# EAGLE design untitled (EAGLE 9.6.2)
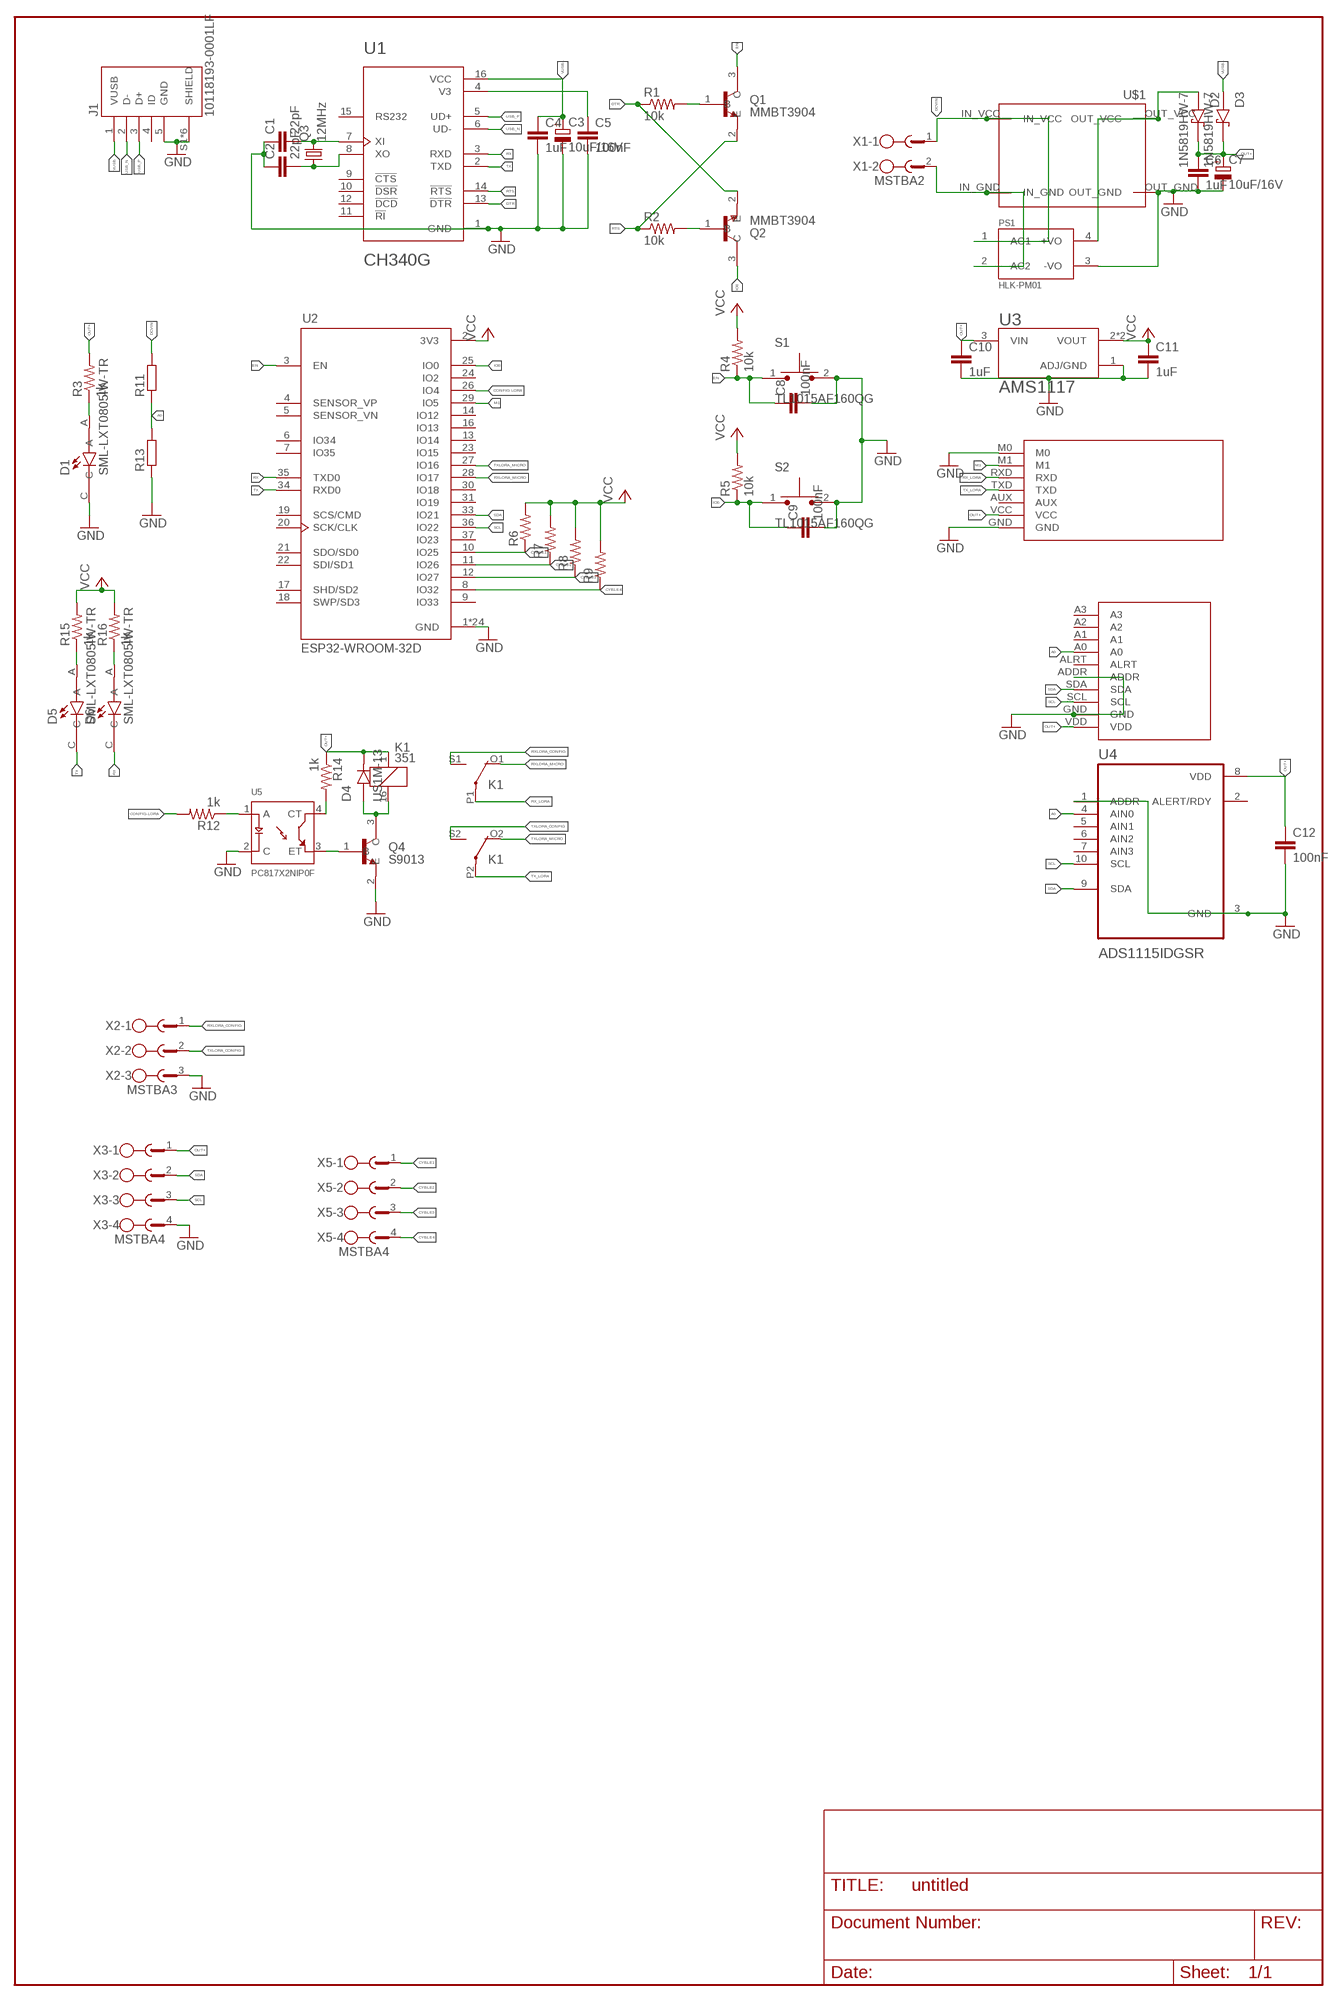
[diagram p0: schematic, sheet 1]

## Parts
ADS1  ADS1115  [ADS1115]
C1  22pF  C-EUC0805K  [C0805K]
C2  22pF  C-EUC0805K  [C0805K]
C3  10uF/16V  CPOL-EU153CLV-0505  [153CLV-0505]
C4  1uF  C-EUC0805K  [C0805K]
C5  100nF  C-EUC0805K  [C0805K]
C6  1uF  C-EUC0805K  [C0805K]
C7  10uF/16V  CPOL-EU153CLV-0505  [153CLV-0505]
C8  100nF  C-EUC0805K  [C0805K]
C9  100nF  C-EUC0805K  [C0805K]
C10  1uF  C-EUC0805K  [C0805K]
C11  1uF  C-EUC0805K  [C0805K]
C12  100nF  C-EUC0805K  [C0805K]
D1  SML-LXT0805IW-TR  [LEDC2012X120N]
D2  1N5819HW-7  [SOD3715X145N]
D3  1N5819HW-7  [SOD3715X145N]
D4  US1M-13  [DIOM5226X240N]
D5  SML-LXT0805IW-TR  [LEDC2012X120N]
D6  SML-LXT0805IW-TR  [LEDC2012X120N]
EBYTEE220-900T22D1  EBYTEE220-900T22D  [EBYTEE220-900T22D]
J1  10118193-0001LF  [FCI_10118193-0001LF]
K1  351  [351]
PS1  HLK-PM01  [CONV_HLK-PM01]
Q1  MMBT3904  [SOT95P240X120-3N]
Q2  MMBT3904  [SOT95P240X120-3N]
Q3  12MHz  CRYSTALSM49  [SM49]
Q4  S9013  [SOT95P240X120-3N]
R1  10k  R-US_M0805  [M0805]
R2  10k  R-US_M0805  [M0805]
R3  1k  R-US_M0805  [M0805]
R4  10k  R-US_M0805  [M0805]
R5  10k  R-US_M0805  [M0805]
R6  R-US_M0805  [M0805]
R7  R-US_M0805  [M0805]
R8  R-US_M0805  [M0805]
R9  R-US_M0805  [M0805]
R11  R-EU_0207/12  [0207/12]
R12  1k  R-US_M0805  [M0805]
R13  R-EU_0207/12  [0207/12]
R14  1k  R-US_M0805  [M0805]
R15  1k  R-US_M0805  [M0805]
R16  1k  R-US_M0805  [M0805]
S1  TL1015AF160QG  [SW_TL1015AF160QG]
S2  TL1015AF160QG  [SW_TL1015AF160QG]
U1  CH340G  [SOIC127P600X180-16N]
U2  ESP32-WROOM-32D  [MODULE_ESP32-WROOM-32D]
U3  AMS1117  [SOT229P700X180-4N]
U4  ADS1115IDGSR  [SOP50P490X110-10N]
U5  PC817X2NIP0F  [SOT254P975X400-4N]
U$1  STEPDOWN_SY8205  [STEPDOWN_SY8205]
X1  MSTBA2  [MSTBA2]
X2  MSTBA3  [MSTBA3]
X3  MSTBA4  [MSTBA4]
X5  MSTBA4  [MSTBA4]

## Nets
A0: ADS1.A0 R11.1 R13.2 U4.4(AIN0)
CONFIG-LORA: R12.2 U2.26(IO4)
CYBLE1: R6.1 U2.10(IO25) X5.1
CYBLE2: R7.1 U2.11(IO26) X5.2
CYBLE3: R8.1 U2.12(IO27) X5.3
CYBLE4: R9.1 U2.8(IO32) X5.4
DCVIN: PS1.1(AC1) R11.2 U$1.IN_VCC X1.1
DTR: Q2.2(E) R1.1 U1.13(!DTR)
EN: C8.1 Q1.3(C) R4.1 S1.1 U2.3(EN)
GND: ADS1.ADDR ADS1.GND C1.1 C2.1 C3.- C4.2 C5.2 C6.2 C7.- C8.2 C9.2 C10.2 C11.2 C12.2 D1.C EBYTEE220-900T22D1.GND EBYTEE220-900T22D1.M0 J1.5(GND) J1.S1(SHIELD) J1.S2(SHIELD) J1.S3(SHIELD) J1.S4(SHIELD) J1.S5(SHIELD) J1.S6(SHIELD) PS1.3(-VO) Q4.2(E) R13.1 S1.2 S2.2 U1.1(GND) U2.1(GND) U2.15(GND) U2.38(GND) U2.39_1(GND) U2.39_2(GND) U2.39_3(GND) U2.39_4(GND) U2.39_5(GND) U2.39_6(GND) U2.39_7(GND) U2.39_8(GND) U2.39_9(GND) U2.39_10(GND) U2.39_11(GND) U2.39_12(GND) U2.39_13(GND) U2.39_14(GND) U2.39_15(GND) U2.39_16(GND) U2.39_17(GND) U2.39_18(GND) U2.39_19(GND) U2.39_20(GND) U2.39_21(GND) U3.1(ADJ/GND) U4.1(ADDR) U4.3(GND) U5.2(C) U$1.OUT_GND X2.3 X3.4
IO0: C9.1 Q2.3(C) R5.1 S2.1 U2.25(IO0)
M1: EBYTEE220-900T22D1.M1 U2.29(IO5)
N$1: C1.2 Q3.2 U1.7(XI)
N$2: C2.2 Q3.1 U1.8(XO)
N$3: Q1.1(B) R1.2
N$4: Q2.1(B) R2.2
N$5: C5.1 U1.4(V3)
N$6: R12.1 U5.1(A)
N$7: D2.A PS1.4(+VO) U$1.OUT_VCC
N$8: Q4.1(B) U5.3(ET)
N$9: R14.2 U5.4(CT)
N$10: PS1.2(AC2) U$1.IN_GND X1.2
N$11: D1.A R3.1
N$12: D5.A R15.1
N$13: D4.A K1.16 Q4.3(C)
N$14: D6.A R16.1
OUT+: ADS1.VDD C6.1 C7.+ C10.1 C12.1 D2.C(K) D3.C(K) D4.C(K) EBYTEE220-900T22D1.VCC K1.1 R3.2 R14.1 U3.3(VIN) U4.8(VDD) X3.1
RTS: Q1.2(E) R2.1 U1.14(!RTS)
RX: D6.C U1.3(RXD) U2.35(TXD0)
RX_LORA: EBYTEE220-900T22D1.RXD K1.P1(2:P)
RXLORA_CONFIG: K1.S1(2:S) X2.1
RXLORA_MICRO: K1.O1(2:O) U2.28(IO17)
SCL: ADS1.SCL U2.36(IO22) U4.10(SCL) X3.3
SDA: ADS1.SDA U2.33(IO21) U4.9(SDA) X3.2
TX: D5.C U1.2(TXD) U2.34(RXD0)
TX_LORA: EBYTEE220-900T22D1.TXD K1.P2(3:P)
TXLORA_CONFIG: K1.S2(3:S) X2.2
TXLORA_MICRO: K1.O2(3:O) U2.27(IO16)
USB_N: J1.2(D-) U1.6(UD-)
USB_P: J1.3(D+) U1.5(UD+)
VCC: C11.1 R4.2 R5.2 R6.2 R7.2 R8.2 R9.2 R15.2 R16.2 U2.2(3V3) U3.2(VOUT) U3.4(VOUT)
VUSB: C3.+ C4.1 D3.A J1.1(VUSB) U1.16(VCC)
Unconnected: ADS1.A1 ADS1.A2 ADS1.A3 ADS1.ALRT EBYTEE220-900T22D1.AUX J1.4(ID) U1.9(!CTS) U1.10(!DSR) U1.11(!RI) U1.12(!DCD) U1.15(RS232) U2.4(SENSOR_VP) U2.5(SENSOR_VN) U2.6(IO34) U2.7(IO35) U2.9(IO33) U2.13(IO14) U2.14(IO12) U2.16(IO13) U2.17(SHD/SD2) U2.18(SWP/SD3) U2.19(SCS/CMD) U2.20(SCK/CLK) U2.21(SDO/SD0) U2.22(SDI/SD1) U2.23(IO15) U2.24(IO2) U2.30(IO18) U2.31(IO19) U2.37(IO23) U4.2(ALERT/RDY) U4.5(AIN1) U4.6(AIN2) U4.7(AIN3)

## Library data of the parts
ADS1 = ds1115:ADS1115
C1 C2 C4-C6 C8-C12 = rcl:C-EU: CAPACITOR, European symbol; SPICEPREFIX: C
C3 C7 = rcl:CPOL-EU: POLARIZED CAPACITOR, European symbol; SPICEPREFIX: C
D1 D5 D6 = SML-LXT0805IW-TR:SML-LXT0805IW-TR: LED; Luminous Intensity:11µcd; Viewing Angle:140°; Forward Current:30mA; Forward Voltage:2V; Color:Red; LED Color:Red; Leaded Process Compatible:Yes; Lens Color:White; Mounting Type:Surface Mount ;RoHS Compliant: Yes Check availability <https://pricing.snapeda.com/parts/SML-LXT0805IW-TR/Lumex%20Opto/Components/view-part?ref=eda>; AVAILABILITY: In Stock; DESCRIPTION: Red - LED Indication - Discrete 2V 0805 (2012 Metric); MF: Lumex Opto/Components; MP: SML-LXT0805IW-TR; PACKAGE: 0805 Lumex; PRICE: None; PURCHASE-URL: https://pricing.snapeda.com/search/part/SML-LXT0805IW-TR/?ref=eda
D2 D3 = 1N5819HW-7:1N5819HW-7: 1N5819HW Series 40 V 1 A Surface Mount Schottky Barrier Rectifier - SOD-123 Check availability <https://pricing.snapeda.com/parts/1N5819HW-7/Diodes%20Inc./view-part?ref=eda>; AVAILABILITY: In Stock; DESCRIPTION: Diode Schottky 40 V 1A Surface Mount SOD-123; MF: Diodes Inc.; MP: 1N5819HW-7; PACKAGE: SOD-123 Fairchild Semiconductor; PRICE: None; PURCHASE-URL: https://pricing.snapeda.com/search/part/1N5819HW-7/?ref=eda
D4 = US1M-13:US1M-13: Diode, Fast Recovery, 1a, 1kv, Do-214ac-2, Full Reel Check availability <https://pricing.snapeda.com/parts/US1M-13/Diodes%20Incorporated/view-part?ref=eda>; AVAILABILITY: In Stock; DESCRIPTION: Diode Standard 1000 V 1A Surface Mount SMA; MF: Diodes Incorporated; MP: US1M-13; PACKAGE: DO-214AC-214 Diodes Incorporated; PRICE: None; PURCHASE-URL: https://pricing.snapeda.com/search/part/US1M-13/?ref=eda
EBYTEE220-900T22D1 = EByte E220-900T22D:EBYTEE220-900T22D
J1 = 10118193-0001LF:10118193-0001LF: Micro USB B Type Receptacle Check availability <https://pricing.snapeda.com/parts/10118193-0001LF/FCI/view-part?ref=eda>; AVAILABILITY: In Stock; DESCRIPTION: USB - micro B USB 2.0 Receptacle Connector 5 Position Surface Mount, Right Angle; Through Hole; MF: FCI; MP: 10118193-0001LF; PACKAGE: None; PRICE: None; PURCHASE-URL: https://pricing.snapeda.com/search/part/10118193-0001LF/?ref=eda
K1 = relay:351: RELAY 2 x switch, Omron; OC_FARNELL: unknown; OC_NEWARK: unknown
PS1 = HLK-PM01:HLK-PM01: Check availability <https://pricing.snapeda.com/parts/hlk-pm01/Hi-link/view-part?ref=eda>; AVAILABILITY: Not in stock; DESCRIPTION: The HLK-PM01 is a small size low cost AC to DC converter which can take in 110V/220V AC at 50/60 Hz and give 5V 3W output. The module is can be used in designs which run on 5V and needs to be powered form the AC mains.; MF: Hi-link; MP: hlk-pm01; PACKAGE: None; PRICE: None
Q1 Q2 = MMBT3904:MMBT3904: MMBT3904 Series 40 V CE Breakdown 0.2 A NPN General Purpose Amplifier - SOT-23 Check availability <https://pricing.snapeda.com/parts/MMBT3904/ON%20Semiconductor/view-part?ref=eda>; AVAILABILITY: In Stock; DESCRIPTION: Bipolar (BJT) Transistor NPN 40 V 200 mA 300MHz 300 mW Surface Mount SOT-23-3 (TO-236); MF: ON Semiconductor; MP: MMBT3904; PACKAGE: SOT-23-3 Motorola; PRICE: None
Q3 = adafruit:CRYSTAL: CRYSTAL; OC_FARNELL: unknown; OC_NEWARK: unknown
Q4 = S9013:S9013: SMD Transistors NPN 25V-500mA Check availability <https://pricing.snapeda.com/parts/S9013/JCET/view-part?ref=eda>; AVAILABILITY: In Stock; DESCRIPTION: Bipolar (BJT) Transistor NPN 20V 500mA 625mW Through Hole TO-92-3; MF: JCET; MP: S9013; PACKAGE: SOT-23-3 JCET; PRICE: None; PURCHASE-URL: https://pricing.snapeda.com/search/part/S9013/?ref=eda
R1-R9 R12 R14-R16 = rcl:R-US_: RESISTOR, American symbol; SPICEPREFIX: R
R11 R13 = rcl:R-EU_: RESISTOR, European symbol; SPICEPREFIX: R
S1 S2 = TL1015AF160QG:TL1015AF160QG: Tactile Switch SPST-NO Top Actuated Surface Mount Check availability <https://pricing.snapeda.com/parts/TL1015AF160QG/E-Switch/view-part?ref=eda>; AVAILABILITY: In Stock; DESCRIPTION: Tactile Switch SPST-NO Top Actuated Surface Mount; MF: E-Switch; MP: TL1015AF160QG; PACKAGE: None; PRICE: None; PURCHASE-URL: https://pricing.snapeda.com/search/part/TL1015AF160QG/?ref=eda
U1 = CH340G:CH340G: Check availability <https://pricing.snapeda.com/parts/Ch340G/WCH/view-part?ref=eda>; AVAILABILITY: Not in stock; DESCRIPTION: USB Interface Integrated Circuit; MF: WCH; MP: Ch340G; PACKAGE: None; PRICE: None
U2 = ESP32-WROOM-32D:ESP32-WROOM-32D: Bluetooth, WiFi 802.11b/g/n, Bluetooth v4.2 + EDR, Class 1, 2 and 3 Transceiver Module 2.4GHz ~ 2.5GHz Integrated, Trace Surface Mount Check availability <https://pricing.snapeda.com/parts/ESP32-WROOM-32D/Espressif%20Systems/view-part?ref=eda>; AVAILABILITY: In Stock; DESCRIPTION: Bluetooth, WiFi 802.11b/g/n, Bluetooth v4.2 +EDR, Class 1, 2 and 3 Transceiver Module 2.4GHz ~ 2.5GHz Integrated; MF: Espressif Systems; MP: ESP32-WROOM-32D; PACKAGE: Module Espressif Systems; PRICE: None; PURCHASE-URL: https://pricing.snapeda.com/search/part/ESP32-WROOM-32D/?ref=eda
U3 = AMS1117:AMS1117: Sot223/Pkg 1-Amp 5-Volt Low Drop Out Voltage Regulatator Check availability <https://pricing.snapeda.com/parts/AMS1117/Advanced%20Monolithic%20Systems/view-part?ref=eda>; AVAILABILITY: Not in stock; DESCRIPTION: 1A LOW DROPOUT VOLTAGE REGULATOR SOT-223; MF: Advanced Monolithic Systems; MP: AMS1117; PACKAGE: SOT-223 Seeed Technology; PRICE: None
U4 = ADS1115IDGSR:ADS1115IDGSR: Check availability <https://pricing.snapeda.com/parts/ADS1115IDGSR/Texas%20Instruments/view-part?ref=eda>; AVAILABILITY: In Stock; DESCRIPTION: 16-bit, 860-SPS, 4-channel, delta-sigma ADC with PGA, oscillator, VREF, comparator and I2C; MF: Texas Instruments; MP: ADS1115IDGSR; PACKAGE: VSSOP-10 Texas Instruments; PRICE: None; PURCHASE-URL: https://pricing.snapeda.com/search/part/ADS1115IDGSR/?ref=eda
U5 = PC817X2NIP0F:PC817X2NIP0F: PC817 Series 1 Channel 80 V 5000 Vrms General Purpose Photocoupler - DIP-4 Check availability <https://pricing.snapeda.com/parts/PC817X2NIP0F/Sharp%20Microelectronics/view-part?ref=eda>; AVAILABILITY: Not in stock; DESCRIPTION: Optoisolator Transistor Output 5000Vrms 1 Channel 4-SMD; MF: Sharp Microelectronics; MP: PC817X2NIP0F; PACKAGE: SMD-4 Sharp Microelectronics; PRICE: None
U$1 = STEPDOWN_SY8205:STEPDOWN_SY8205
X1 = con-phoenix-508:MSTBA2: PHOENIX; MF: FARNELL; MPN: 1757242; OC_FARNELL: 3705171; OC_NEWARK: 71C4161
X2 = con-phoenix-508:MSTBA3: PHOENIX; MF: FARNELL; MPN: 1757255; OC_FARNELL: 3705183; OC_NEWARK: 71C4162
X3 X5 = con-phoenix-508:MSTBA4: PHOENIX; MF: FARNELL; MPN: 1757268; OC_FARNELL: 3705195; OC_NEWARK: 71C4163

## Board
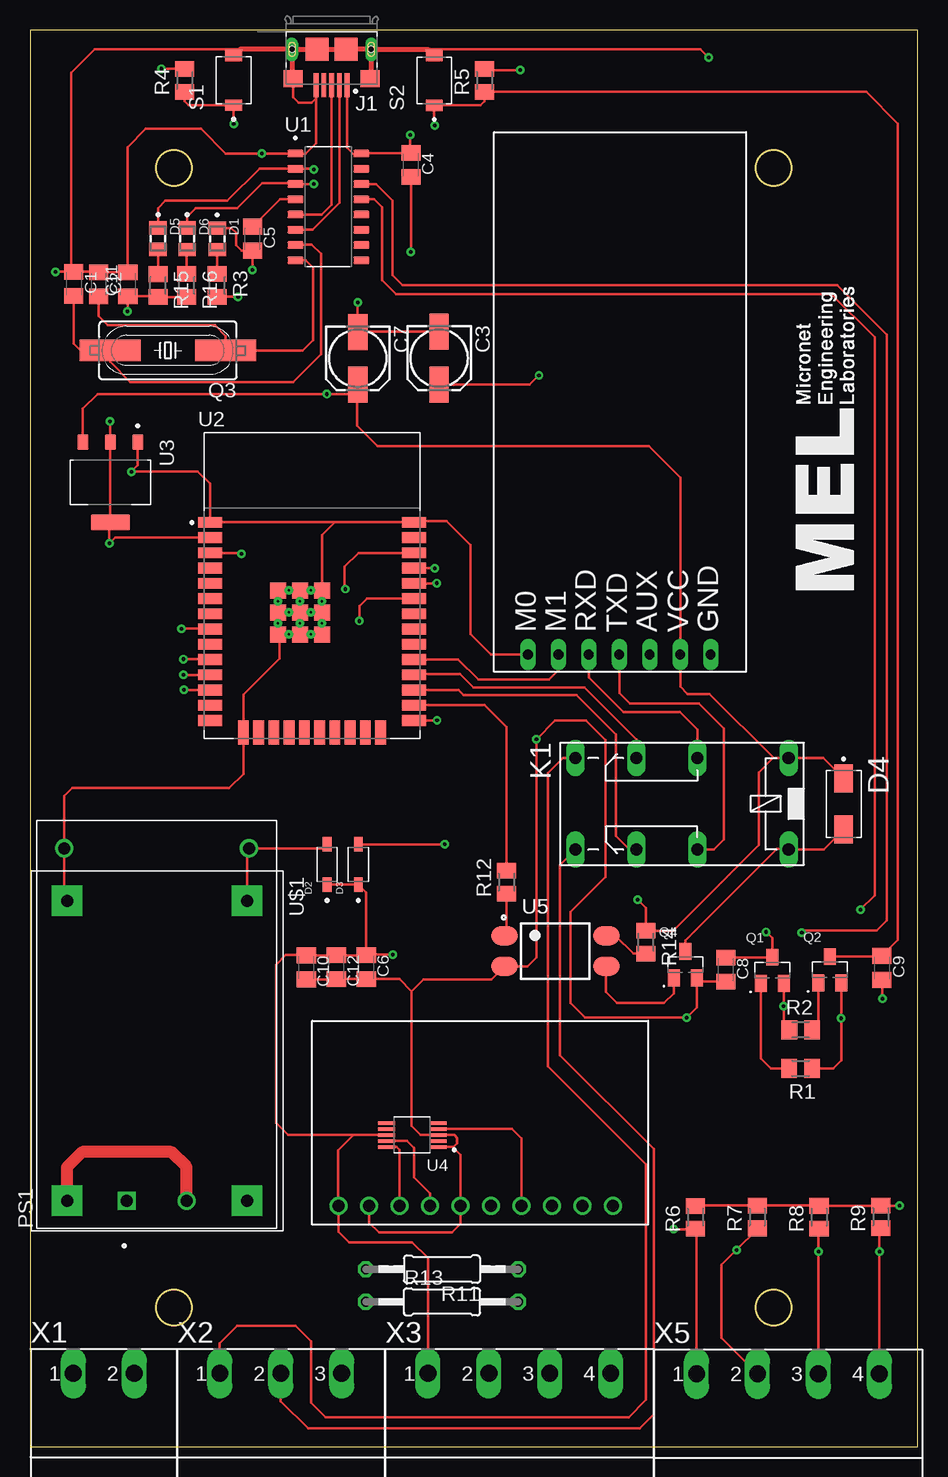
[diagram p1: board, top side]
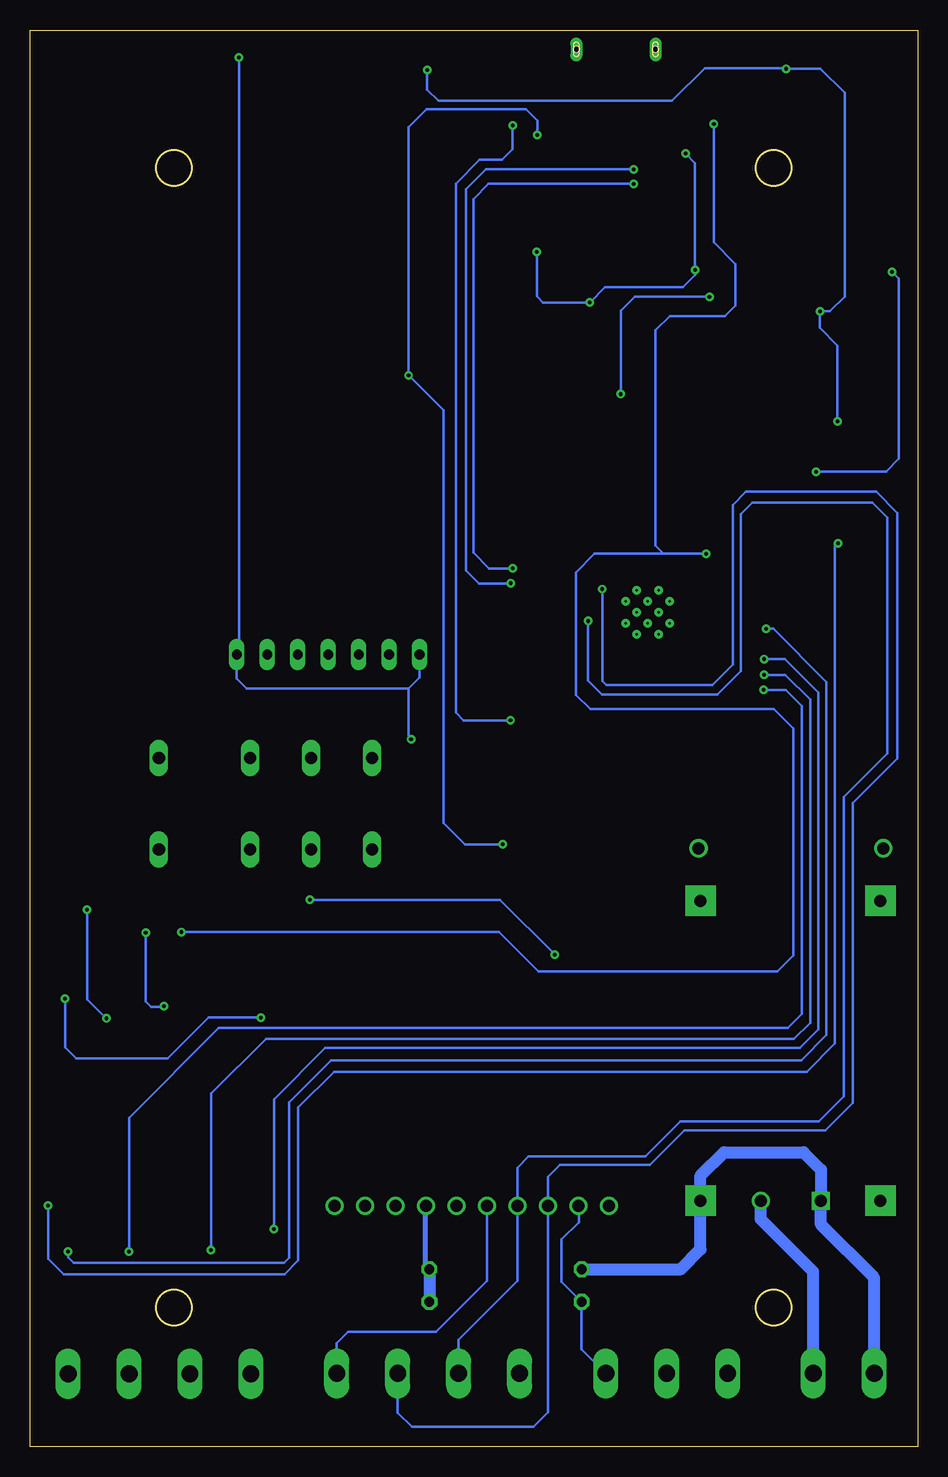
[diagram p2: board, bottom side, seen from below]

Size 74 x 118.1 mm. Coordinates in mm from the lower left corner, seen from the top.
Outline: 74,0 74,118.1 0,118.1 0,0 74,0
Outline: circle at 12,11.6 radius 1.5
Outline: circle at 62,11.6 radius 1.5
Outline: circle at 62,106.6 radius 1.5
Outline: circle at 12,106.6 radius 1.5
Copper layers (1*16): Top 0.035mm / dielectric 1.5mm / Bottom 0.035mm
Design rules "default *": minimum track width 6mil, minimum drill 0.3mm, track to track 6mil, track to pad 6mil, pad to pad 6mil, via to via 6mil, smd to smd 6mil, copper to edge 40mil, drill to drill 6mil, minimum pad ring 10mil, minimum via ring 8mil, stop-mask expansion 4mil, vias tented up to drill 0mil, thermal gap 10mil

### Footprints (pad centres in the part's own frame; a part is rotated, then mirrored left to right if it is on the bottom)
ADS1115 = drill 1: A0 -6.35,-1.27; A1 -6.35,-3.81; A2 -6.35,-6.35; A3 -6.35,-8.89; ADDR -6.35,3.81; ALRT -6.35,1.27; GND -6.35,11.43; SCL -6.35,8.89; SDA -6.35,6.35; VDD -6.35,13.97
C0805K = smd 1.3 x 1.6: 1 -1,0; 2 1,0
153CLV-0505 = smd 3 x 1.6: + 2.2,0; - -2.2,0
LEDC2012X120N = smd 1.1 x 1.45: A 0.9,0; C -0.9,0
SOD3715X145N = smd 1.21 x 0.73: A 1.68,0; C -1.68,0
DIOM5226X240N = smd 2.33 x 1.55: A 2.135,0; C -2.135,0
EBYTEE220-900T22D = drill 0.8 pad 1.27 long: AUX -4.56,-10.98; GND -4.56,-16.06; M0 -4.56,-0.82; M1 -4.56,-3.36; RXD -4.56,-5.9; TXD -4.56,-8.44; VCC -4.56,-13.52
FCI_10118193-0001LF = smd 0.4 x 2: 1 -1.3,2.975; 2 -0.65,2.975; 3 0,2.975; 4 0.65,2.975; 5 1.3,2.975 | smd 1.6 x 1.4: S1 -3.2,2.45; S2 3.2,2.45 | smd 1.9 x 1.9: S3 1.2,0; S4 -1.2,0 | drill 0.5 pad 0.9 long: S5 -3.3,0; S6 3.3,0 | hole 0.5: -3.3,0; 3.3,0
351 = drill 1.016 long: 1 -3.81,-3.81; 16 -3.81,3.81; O1 8.89,-3.81; O2 8.89,3.81; P1 3.81,-3.81; P2 3.81,3.81; S1 13.97,-3.81; S2 13.97,3.81
CONV_HLK-PM01 = drill 1 square: 1 -14.7,2.5 | drill 1: 2 -14.7,-2.5; 3 14.7,7.7; 4 14.7,-7.7
SOT95P240X120-3N = smd 1 x 1.4: 1 -0.95,-1.1; 2 0.95,-1.1; 3 0,1.1
SM49 = smd 5.08 x 1.778: 1 -4.826,0; 2 4.826,0
M0805 = smd 1.3 x 1.6: 1 -0.95,0; 2 0.95,0
0207/12 = drill 0.813 octagon: 1 -6.35,0; 2 6.35,0
SW_TL1015AF160QG = smd 0.95 x 1.4: 1 -2.075,0; 2 2.075,0
SOIC127P600X180-16N = smd 1.31 x 0.62: 1 -2.75,4.445; 2 -2.75,3.175; 3 -2.75,1.905; 4 -2.75,0.635; 5 -2.75,-0.635; 6 -2.75,-1.905; 7 -2.75,-3.175; 8 -2.75,-4.445; 9 2.75,-4.445; 10 2.75,-3.175; 11 2.75,-1.905; 12 2.75,-0.635; 13 2.75,0.635; 14 2.75,1.905; 15 2.75,3.175; 16 2.75,4.445
MODULE_ESP32-WROOM-32D = smd 2 x 0.9: 1 -8.5,5.26; 2 -8.5,3.99; 3 -8.5,2.72; 4 -8.5,1.45; 5 -8.5,0.18; 6 -8.5,-1.09; 7 -8.5,-2.36; 8 -8.5,-3.63; 9 -8.5,-4.9; 10 -8.5,-6.17; 11 -8.5,-7.44; 12 -8.5,-8.71; 13 -8.5,-9.98; 14 -8.5,-11.25; 25 8.5,-11.25; 26 8.5,-9.98; 27 8.5,-8.71; 28 8.5,-7.44; 29 8.5,-6.17; 30 8.5,-4.9; 31 8.5,-3.63; 32 8.5,-2.36; 33 8.5,-1.09; 34 8.5,0.18; 35 8.5,1.45; 36 8.5,2.72; 37 8.5,3.99; 38 8.5,5.26 | smd 0.9 x 2: 15 -5.715,-12.25; 16 -4.445,-12.25; 17 -3.175,-12.25; 18 -1.905,-12.25; 19 -0.635,-12.25; 20 0.635,-12.25; 21 1.905,-12.25; 22 3.175,-12.25; 23 4.445,-12.25; 24 5.715,-12.25 | smd 1.33 x 1.33: 39_1 -2.835,-0.405; 39_2 -1,-0.405; 39_3 0.835,-0.405; 39_4 -2.835,-2.24; 39_5 -1,-2.24; 39_6 0.835,-2.24; 39_7 -2.835,-4.075; 39_8 -1,-4.075; 39_9 0.835,-4.075 | drill 0.2 pad 0.3: 39_10 -1.917,-0.405; 39_11 -0.083,-0.405; 39_12 -2.835,-1.323; 39_13 -1,-1.323; 39_14 0.835,-1.323; 39_15 -1.917,-2.24; 39_16 -0.083,-2.24; 39_17 -2.835,-3.158; 39_18 -1,-3.158; 39_19 0.835,-3.158; 39_20 -1.917,-4.075; 39_21 -0.083,-4.075
SOT229P700X180-4N = smd 1.31 x 0.93: 1 -3.345,2.29; 2 -3.345,0; 3 -3.345,-2.29 | smd 1.31 x 3.24: 4 3.345,0
SOP50P490X110-10N = smd 1.47 x 0.28: 1 -2.15,1; 2 -2.15,0.5; 3 -2.15,0; 4 -2.15,-0.5; 5 -2.15,-1; 6 2.15,-1; 7 2.15,-0.5; 8 2.15,0; 9 2.15,0.5; 10 2.15,1
SOT254P975X400-4N = smd 2.25 x 1.6: 1 -4.25,1.27; 2 -4.25,-1.27; 3 4.25,-1.27; 4 4.25,1.27
STEPDOWN_SY8205 = drill 1 pad 2.54 square: IN_GND 18,-2.5; IN_VCC 3,-2.5; OUT_GND 18,-27.5; OUT_VCC 3,-27.5
MSTBA2 = drill 1.397 long: 1 -2.54,5.08; 2 2.54,5.08
MSTBA3 = drill 1.397 long: 1 -5.08,5.08; 2 0,5.08; 3 5.08,5.08
MSTBA4 = drill 1.397 long: 1 -7.62,5.08; 2 -2.54,5.08; 3 2.54,5.08; 4 7.62,5.08

### Placement (x,y rotation side)
ADS1  39.7,26.43 90 top
C1  3.66,96.93 270 top
C2  5.73,96.9 270 top
C3  34.11,90.74 270 top
C4  31.76,106.85 270 top
C5  18.56,100.71 270 top
C6  28.04,39.98 270 top
C7  27.33,90.73 270 top
C8  58.01,39.77 270 top
C9  71.03,39.92 270 top
C10  23.04,39.96 270 top
C11  8.16,96.9 90 top
C12  25.54,39.97 270 top
D1  15.61,100.69 270 top
D2  24.77,48.53 90 top
D3  27.38,48.54 90 top
D4  67.84,53.58 270 top
D5  10.68,100.7 270 top
D6  13.11,100.7 270 top
EBYTEE220-900T22D1  40.7,70.6 90 top
J1  25.15,116.49 180 top
K1  59.45,53.6 180 top
PS1  10.55,35.19 90 top
Q1  61.9,39.71 0 top
Q2  66.69,39.75 0 top
Q3  11.5,91.38 180 top
Q4  54.65,40.18 0 top
R1  64.26,31.53 180 top
R2  64.26,34.74 0 top
R3  15.61,96.8 270 top
R4  12.9,113.9 90 top
R5  37.9,113.89 90 top
R6  55.49,19.12 90 top
R7  60.64,19.16 90 top
R8  65.79,19.13 90 top
R9  70.93,19.16 90 top
R11  34.36,14.8 180 top
R12  39.73,47.06 90 top
R13  34.35,12.08 0 top
R14  51.36,42.06 270 top
R15  10.68,96.8 270 top
R16  13.06,96.8 270 top
S1  16.99,113.9 90 top
S2  33.71,113.88 90 top
U1  24.88,103.35 0 top
U2  23.51,71.79 0 top
U3  6.7,80.4 270 top
U4  31.87,25.99 180 top
U5  43.81,41.31 0 top
U$1  21.09,18.01 180 top
X1  6.15,1.04 0 top
X2  20.91,1.03 0 top
X3  40.8,1.03 0 top
X5  63.2,1 0 top

### Tracks (layer width: path | path; a pad name or v marks a point on that pad's centre or on a via)
A0
  Top 0.203: ADS1.A0 40.97,25.72 40.2,26.49 U4.4
  Bottom 0.406: ADS1.A0 41.05,20 41.05,15.15 R11.1
  Bottom 1.016: R11.1 R13.2
CONFIG-LORA
  Top 0.203: R12.2 39.73,59.98 37.9,61.81 U2.26
CYBLE1  (via drill 0.3)
  Top 0.203: X5.1 55.58,18.08 R6.1 55.45,18.14 v53.66,18.14 | v12.78,65.66 14.97,65.66 U2.10
  Bottom 0.203: v53.66,18.14 53.66,28.96 49.38,33.24 9.8,33.24 8.25,34.78 8.25,62.87 11.06,65.68 12.78,65.68 v12.78,65.66
CYBLE2  (via drill 0.3)
  Top 0.203: X5.2 57.65,9.09 57.65,15.15 v58.9,16.41 60.64,18.14 R7.1 | v12.79,64.34 U2.11
  Bottom 0.203: v58.9,16.41 58.9,29.43 54.33,34 10.3,34 8.96,35.34 8.96,62.27 11.03,64.34 v12.79,64.34
CYBLE3  (via drill 0.3)
  Top 0.203: X5.3 v65.74,16.28 65.74,18.13 R8.1 | v12.82,63.1 14.99,63.1 U2.12
  Bottom 0.203: v65.74,16.28 65.74,27.43 58.27,34.9 10.8,34.9 9.63,36.07 9.63,61.73 11,63.1 v12.82,63.1
CYBLE4  (via drill 0.3)
  Top 0.203: X5.4 v70.82,16.26 70.82,18.1 R9.1 | v12.63,68.19 14.98,68.19 U2.8
  Bottom 0.203: v70.82,16.26 70.82,15.78 70.37,15.33 52.81,15.33 52.38,15.76 52.38,28.72 48.89,32.22 9.69,32.22 7.58,34.32 7.58,63.75 12.02,68.19 v12.63,68.19
DCVIN
  Bottom 1.016: X1.1 3.61,14.06 8.05,18.51 PS1.1 8.05,23.08 9.51,24.55 16.14,24.55 18.09,22.6 U$1.IN_VCC 18.09,16.44 19.72,14.8 R11.2
DTR  (via drill 0.3)
  Top 0.203: R1.1 66.96,31.53 67.64,32.2 v67.64,35.7 Q2.2 | U1.13 28.7,103.99 29.36,103.33 29.36,97.24 30.5,96.1 66.83,96.1 70.42,92.51 70.42,45.95 v69.24,44.77
  Bottom 0.203: v69.24,44.77 69.24,37.3 v67.65,35.7 v67.64,35.7
EN  (via drill 0.3)
  Top 0.203: R4.1 12.9,112.16 13.23,111.83 S1.1 16.98,111.82 v16.98,110.25 | C8.1 61.85,40.77 Q1.3 61.9,42.4 v61.39,42.91 | U2.3 17.55,74.51 v17.62,74.44
  Bottom 0.203: v16.98,110.25 17,110.23 17,100.43 15.17,98.6 15.17,95.13 16.05,94.25 20.66,94.25 21.84,93.07 21.84,75.12 21.17,74.44 v17.62,74.44 26.93,74.44 28.49,72.89 28.49,62.68 27.29,61.48 11.99,61.48 10.36,59.85 10.36,40.94 11.69,39.61 31.59,39.61 34.9,42.91 v61.39,42.91
GND  (via drill 0.3)
  Top 0.203: J1.S2 21.95,112.5 22.4,112.05 23.49,112.05 23.85,112.41 | 23.85,112.41 J1.5 | 35.23,24.99 35.31,24.99 35.62,25.29 35.62,25.76 35.39,25.99 U4.3 32.58,25.99 31.81,26.76 31.81,37.97 | 35.23,24.99 U4.1 | ADS1.ADDR 35.89,20.44 | 35.89,20.44 35.89,24.33 35.23,24.99 | C3.- 27.34,92.95 C7.- v27.33,95.38 v27.33,95.39 | 23.85,112.41 23.85,108.68 22.97,107.8 U1.1 v19.35,107.8 16.32,107.8 14.26,109.86 9.64,109.86 8.13,108.35 8.13,97.9 | U$1.OUT_GND 2.85,45.74 PS1.3 2.85,54.25 3.53,54.93 16.62,54.93 17.79,56.1 U2.15 17.79,62.69 20.81,65.7 20.81,67.72 | C10.2 23.05,38.97 C12.2 25.54,38.98 C6.2 30.8,38.98 31.81,37.97 | U2.39_2 U2.39_11 U2.39_3 | U2.39_2 U2.39_10 U2.39_1 U2.39_12 U2.39_4 | U2.39_3 U2.39_14 U2.39_6 24.22,69.55 | U2.39_2 22.51,71.37 U2.39_13 22.51,69.57 | 22.51,69.57 U2.39_5 | U2.39_4 | 20.69,69.55 U2.39_15 21.61,69.57 22.51,69.57 | 20.69,69.55 U2.39_4 | U2.39_5 U2.39_16 24.22,69.55 | 24.22,69.55 24.22,68.76 U2.39_19 U2.39_9 U2.39_21 U2.39_8 22.51,67.75 | U2.39_5 U2.39_18 22.51,67.75 | 20.69,69.55 20.67,69.54 U2.39_17 20.67,67.77 | 20.67,67.77 U2.39_7 | 20.81,67.72 U2.39_20 21.63,67.75 22.51,67.75 | 20.81,67.72 20.73,67.72 20.67,67.77 | C9.2 71.04,38.9 71.04,37.38 v71.08,37.35 | ADS1.GND 28.27,18.68 29.09,17.86 35.17,17.86 35.9,18.59 35.9,20.43 35.89,20.44 | U2.39_3 24.34,76 25.43,77.09 | 25.43,77.09 31.97,77.09 U2.38 32.12,77.16 34.74,77.16 36.75,75.16 36.75,67.75 38.46,66.04 EBYTEE220-900T22D1.M0 | 31.81,37.97 32.8,38.96 38.48,38.96 U5.2 41.46,40.04 42.23,40.81 v42.23,58.97 43.77,60.52 46.37,60.52 47.98,58.91 47.98,47.51 45.06,44.59 45.06,37.01 46.29,35.78 v54.76,35.78 55.6,36.62 Q4.2 55.91,38.77 C8.2
  Top 0.203: U3.1 8.99,81.83 v8.44,81.28 14,81.28 15.01,80.27 15.01,77.07 | v2.12,97.95 3.42,97.95 | 3.42,97.95 3.64,97.95 C1.1 5.7,97.93 C2.1 8.13,97.9 | U2.1 15.01,77.07 | 25.43,77.09 15.02,77.09 15.01,77.07 | C5.2 18.55,99.71 | 18.55,99.71 17.64,99.71 17.17,100.18 17.17,101.18 16.77,101.59 D1.C | v18.55,98.11 18.55,99.71 | 8.13,97.9 C11.2 | 17.5,116.49 5.38,116.49 3.42,114.53 3.42,97.95 | C4.2 31.76,99.64 v31.74,99.61 | 32.99,116.49 55.9,116.49 v56.57,115.81
  Top 0.406: J1.S5 28.45,114.14 J1.S1 | J1.S5 J1.S4 J1.S3 J1.S6 | J1.S6 21.85,114.14 J1.S2 | J1.S5 32.99,116.49 33.17,116.49 S2.2 | J1.S6 17.5,116.49 S1.2
  Bottom 0.203: X2.3 28,8.12 R13.1 29.67,13.74 29.67,17.28 28.24,18.71 28.24,20.05 ADS1.GND | X3.4 48.42,8.62 47.46,9.57 40.14,9.57 35.88,13.84 ADS1.ADDR | EBYTEE220-900T22D1.GND 56.76,66.03 | 56.76,66.03 56.76,64.03 55.94,63.21 42.44,63.21 | EBYTEE220-900T22D1.M0 41.52,64.13 42.44,63.21 | v8.44,81.28 2.62,81.28 1.54,82.36 1.54,97.37 v2.12,97.95 | v18.55,98.11 18.55,97.65 19.54,96.66 26.06,96.66 v27.33,95.39 31.22,95.39 31.74,95.91 v31.74,99.61 | 18.39,97.95 v18.55,98.11 | 42.44,63.21 42.44,59.21 42.23,58.99 v42.23,58.97 | v56.57,115.81 56.57,66.21 56.76,66.03 | v54.76,35.78 59.1,35.78 62.5,32.38 70.16,32.38 71.08,33.3 v71.08,37.35 | v18.55,98.11 18.55,107.02 19.35,107.81 v19.35,107.8
IO0  (via drill 0.3)
  Top 0.203: Q2.3 70.97,40.85 C9.1 72.37,42.25 72.37,110.31 69.74,112.94 R5.1 37.9,112.16 37.55,111.81 S2.1 33.71,110.2 v33.76,110.15 | v33.94,60.55 32.02,60.55 U2.25
  Bottom 0.203: v33.76,110.15 33.76,108.18 34.66,107.27 36.51,107.27 38.5,105.28 38.5,61.2 37.83,60.54 v33.95,60.54 v33.94,60.55
M1
  Top 0.203: EBYTEE220-900T22D1.M1 44.06,64.73 43.29,63.96 37.38,63.96 35.7,65.64 32.02,65.64 U2.29
N$1
  Top 0.203: C1.2 3.66,91.94 4.21,91.38 Q3.2 6.67,90.44 8.36,88.75 21.93,88.75 24.25,91.08 24.25,99.44 23.5,100.2 22.16,100.2 U1.7
N$2
  Top 0.203: C2.2 5.73,94.24 6.48,93.5 15.42,93.5 16.32,92.59 Q3.1 22.74,91.38 23.59,92.23 23.59,98.28 22.96,98.91 U1.8
N$3
  Top 0.203: R1.2 61.78,31.53 60.95,32.36 Q1.1
N$4
  Top 0.203: R2.2 65.74,35.26 Q2.1
N$5
  Top 0.203: C5.1 20.84,103.99 U1.4
N$6
  Top 0.203: U5.1 39.73,42.76 R12.1
N$7
  Top 0.203: D2.A 24.45,49.89 18.27,49.89 | 18.27,49.89 PS1.4 | U$1.OUT_VCC 18.09,49.71 18.27,49.89
N$8
  Top 0.203: Q4.1 53.7,37.81 52.87,36.98 48.95,36.98 48.03,37.9 48.03,40.01 U5.3
N$9
  Top 0.203: R14.2 50.29,41.11 48.81,42.59 48.07,42.59 U5.4
N$10
  Top 1.016: PS1.2 13.05,23.31 11.79,24.58 4.37,24.58 3.08,23.28 3.08,20.52 U$1.IN_GND
  Bottom 1.016: X1.2 8.69,14.59 13.07,18.97 13.07,20.47 PS1.2
N$11
  Top 0.203: R3.1 D1.A
N$12
  Top 0.203: R15.1 D5.A
N$13
  Top 0.203: D4.A 66.18,49.79 63.35,49.79 | 63.35,49.79 K1.16 | Q4.3 54.65,42.2 62.29,49.83 63.3,49.83 63.35,49.79
N$14
  Top 0.203: R16.1 13.06,99.76 D6.A
OUT+  (via drill 0.3)
  Top 0.203: C7.+ 27.27,88.47 | 27.27,88.47 26.55,87.75 v24.73,87.75 5.62,87.75 4.41,86.53 U3.3 | C10.1 23.28,40.96 | 23.28,40.96 25.52,40.96 C12.1 28.03,40.97 C6.1 28.04,41.22 | D4.C 66.14,57.41 K1.1 | K1.1 61.95,57.41 60.76,56.21 60.76,50.17 53.6,43.01 R14.1 51.36,44.91 v50.68,45.59 | D2.C D3.C 28.04,46.2 28.04,41.22 | U4.8 26.98,25.99 | 26.98,25.99 25.71,24.71 25.71,20.1 ADS1.VDD 25.73,17.91 26.6,17.04 31.86,17.04 33.18,15.73 X3.1 | 26.98,25.99 21.51,25.99 20.51,26.99 20.51,40.17 21.32,40.98 23.25,40.98 23.28,40.96 | K1.1 62.01,57.41 56.66,62.76 54.82,62.76 54.22,63.36 EBYTEE220-900T22D1.VCC 54.22,80.79 51.59,83.42 28.98,83.42 27.27,85.14 27.27,88.47 | v17.35,95.86 v17.34,95.86 R3.2 | v30.23,41.03 28.23,41.03 28.04,41.22
  Bottom 0.203: v24.73,87.75 24.73,94.69 23.56,95.86 v17.35,95.86 | v17.35,95.86 | v50.68,45.59 34.79,45.59 v30.23,41.03
RTS  (via drill 0.3)
  Top 0.203: R2.1 62.85,35.2 v62.85,36.73 Q1.2 | U1.14 28.85,105.26 30.23,103.88 30.23,97.66 31.06,96.84 67.31,96.84 71.43,92.72 71.43,43.86 70.61,43.04 64.55,43.04 v64.35,42.85
  Bottom 0.203: v64.35,42.85 64.35,37.12 63.89,36.66 62.89,36.66 62.83,36.73 v62.85,36.73
RX  (via drill 0.3)
  Top 0.203: D6.C 13.11,102.54 13.79,103.23 17.28,103.23 19.37,105.32 22.07,105.32 U1.3 23.67,105.26 v23.68,105.27 | v33.76,73.22 33.74,73.24 U2.35
  Bottom 0.203: v23.68,105.27 35.76,105.27 37.01,104.02 37.01,74.52 35.71,73.22 v33.76,73.22
RX_LORA
  Top 0.203: K1.P1 55.64,59.8 54.21,61.23 49.49,61.23 46.6,64.12 EBYTEE220-900T22D1.RXD
RXLORA_CONFIG
  Top 0.203: X2.1 15.83,8.61 17.29,10.06 22.16,10.06 23.43,8.8 23.43,3.68 24.64,2.47 49.93,2.47 51.37,3.92 51.37,23.53 43.18,31.72 43.18,56.15 44.43,57.41 K1.S1
RXLORA_MICRO
  Top 0.203: K1.O1 50.56,58.95 46.24,63.27 36.98,63.27 35.85,64.41 32.06,64.41 U2.28
SCL  (via drill 0.3)
  Top 0.203: ADS1.SCL 30.81,24.75 30.57,24.99 U4.10 | U2.36 27.38,74.51 26.25,73.38 26.25,71.53 v26.28,71.5
  Bottom 0.203: X3.3 43.34,2.85 42.14,1.65 32.03,1.65 30.81,2.87 30.81,20.04 | 30.81,20.04 ADS1.SCL | v26.28,71.5 26.28,63.85 25.93,63.49 17.11,63.49 15.41,65.19 15.41,78.49 14.3,79.61 3.46,79.61 1.68,77.84 1.68,57.37 5.41,53.65 5.41,28.65 7.69,26.37 19.46,26.37 22.32,23.51 29.79,23.51 30.82,22.48 30.82,20.06 30.81,20.04
SDA  (via drill 0.3)
  Top 0.203: ADS1.SDA 33.35,21.12 32.02,22.44 32.02,24.9 31.43,25.49 U4.9 | U2.33 28.09,70.7 27.47,70.09 v27.47,68.83
  Bottom 0.203: X3.2 38.26,8.9 33.35,13.81 ADS1.SDA 33.36,23.26 32.43,24.19 22.7,24.19 19.78,27.11 8.23,27.11 6.14,29.2 6.14,54.17 2.52,57.79 2.52,77.46 3.77,78.71 13.76,78.71 14.73,77.73 14.73,64.67 16.7,62.7 26.3,62.7 27.47,63.86 v27.47,68.83
TX  (via drill 0.3)
  Top 0.203: D5.C 10.68,103.25 11.28,103.86 16.46,103.86 19.13,106.53 U1.2 23.63,106.53 v23.67,106.49 | v33.92,71.99 33.9,71.97 U2.34
  Bottom 0.203: v23.67,106.49 35.99,106.49 37.65,104.83 37.65,73.04 36.57,71.96 33.95,71.96 v33.92,71.99
TX_LORA
  Top 0.203: K1.P2 57.01,49.79 57.85,50.63 57.85,59.88 55.78,61.96 50.02,61.96 49.13,62.84 EBYTEE220-900T22D1.TXD
TXLORA_CONFIG
  Top 0.203: X2.2 20.91,3.78 23.17,1.52 50.83,1.52 52.03,2.71 52.03,24.82 44.21,32.64 44.21,48.51 K1.S2
TXLORA_MICRO
  Top 0.203: K1.O2 49.99,49.79 48.85,50.93 48.85,59.38 45.55,62.68 36.13,62.68 35.71,63.1 32.02,63.1 U2.27
USB_N
  Top 0.203: J1.2 25.8,103.7 23.55,101.45 U1.6
USB_P
  Top 0.203: J1.3 25.15,103.55 24.31,102.72 U1.5
VCC  (via drill 0.3)
  Top 0.203: R16.2 R15.2 10.62,95.9 C11.1 8.14,95.88 v8.14,94.66 | R6.2 55.52,20.11 R7.2 65.76,20.11 R8.2 70.9,20.08 R9.2 70.95,20.09 v72.49,20.09 | U2.2 7.09,75.78 v6.62,75.32 6.62,76.98 U3.4 U3.2 6.7,85.46 6.69,85.47 v6.67,85.47 | v10.96,114.87 12.88,114.87 R4.2 | R5.2 37.97,114.76 v40.88,114.76
  Bottom 0.203: v6.67,85.47 6.67,91.81 8.16,93.29 8.16,94.64 v8.14,94.66 7.3,94.66 6.08,95.87 6.08,112.86 8.09,114.87 10.76,114.87 | 10.76,114.87 v10.96,114.87 | v40.88,114.76 40.88,113.13 39.94,112.19 20.47,112.19 17.75,114.9 10.79,114.9 10.76,114.87 | v72.49,20.09 72.49,15.68 71.18,14.38 52.78,14.38 51.63,15.53 51.63,28.28 48.65,31.26 9.22,31.26 6.87,33.61 6.87,75.06 v6.62,75.32
VUSB  (via drill 0.3)
  Top 0.203: J1.1 26.45,108.29 27,107.74 27.57,107.74 U1.16 27.68,107.85 C4.1 | 31.78,107.86 C4.1 | C3.+ 41.66,88.55 v42.44,89.32 | v31.7,109.36 31.7,107.91 C4.1 | D3.A v34.57,50.22 v34.57,50.21
  Bottom 0.203: v31.7,109.36 31.7,110.54 32.65,111.49 40.94,111.49 42.44,109.99 v42.44,89.32 39.51,86.39 39.51,51.99 37.73,50.21 v34.57,50.21